# Altium schematic sheet Relay off delay.SchDoc
size A4
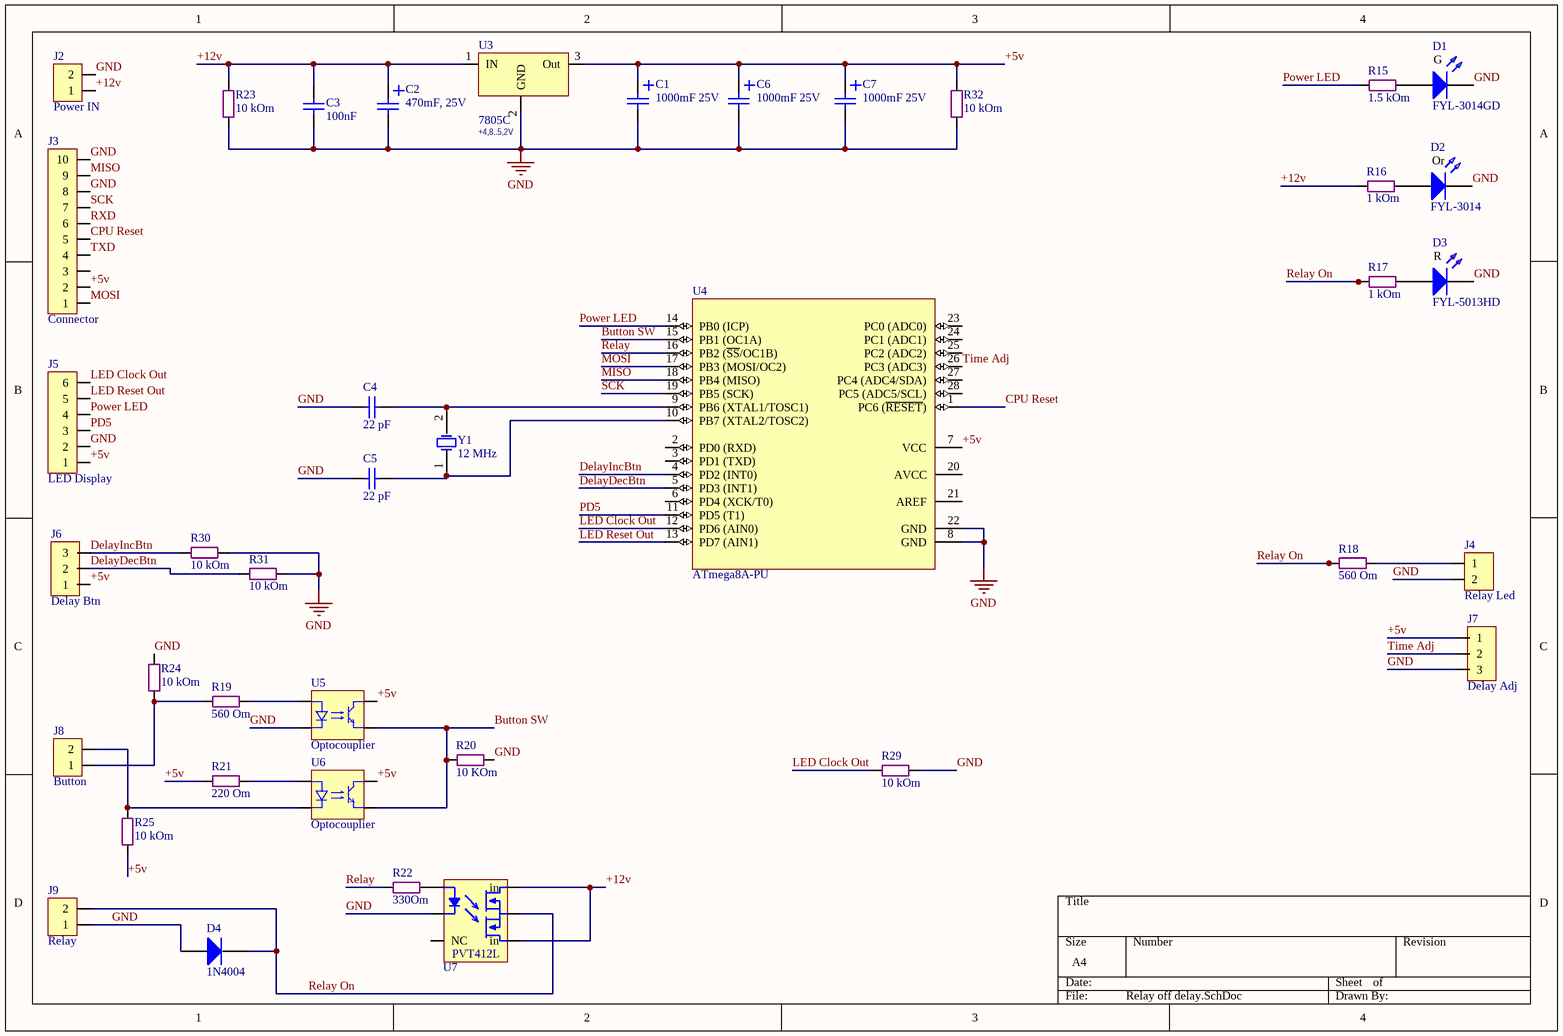
[diagram p0: Relay off delay.SchDoc]

## Parts
C1  1000mF 25V  [Cap E p5.08mm D10.2mm (3p)]
C2  470mF, 25V  [Cap E p3.5mm D8xH12]
C3  100nF  [Cap P5.08MM (3p) disk2]
C4  22 pF  [Cap P5.08MM (3p) disk2]
C5  22 pF  [Cap P5.08MM (3p) disk2]
C6  1000mF 25V  [Cap E p5.08mm D10.2mm (3p)]
C7  1000mF 25V  [Cap E p5.08mm D10.2mm (3p)]
D1  FYL-3014GD  [LED Round 3mm Green]
D2  FYL-3014  [LED Round 3mm Yellow]
D3  FYL-5013HD  [LED Round 3mm red]
D4  1N4004  [Diode DO-35]
J2  Power IN  [CWF-2 R]
J3  Connector  [LINE 2.54 x 10D (2 x 5) - BH]
J4  Relay Led  [CWF-2 R]
J5  LED Display  [Molex Micro-Fit 3.0 - 6 pin D R]
J6  Delay Btn  [WF-3]
J7  Delay Adj  [WF-3]
J8  Button  [CWF-2 R]
J9  Relay  [CWF-2 R]
R15  1.5 kOm  [SMD 0805 (2012)]
R16  1 kOm  [SMD 0805 (2012)]
R17  1 kOm  [SMD 0805 (2012)]
R18  560 Om  [SMD 0805 (2012)]
R19  560 Om  [SMD 0805 (2012)]
R20  10 KOm  [SMD 0805 (2012)]
R21  220 Om  [SMD 0805 (2012)]
R22  330Om  [SMD 1206 (3216)]
R23  10 kOm  [SMD 0805 (2012)]
R24  10 kOm  [SMD 0805 (2012)]
R25  10 kOm  [SMD 0805 (2012)]
R29  10 kOm  [Res p7.62 (4p) 0.25w]
R30  10 kOm  [Res p7.62 (4p) 0.25w]
R31  10 kOm  [Res p7.62 (4p) 0.25w]
R32  10 kOm  [SMD 0805 (2012)]
U3  7805C  V Out: +4,8..5,2V  [D-PAK]
U4  ATmega8A-PU  [28P3]
U5  Optocouplier  [DIP-4]
U6  Optocouplier  [DIP-4]
U7  PVT412L  [DIP-6]  (value not drawn)
Y1  12 MHz  [XTAL - 2]

## Nets
GND: C1.2 C2.2 C3.2 C4.1 C5.1 C6.2 C7.2 D1.K D2.K D3.K D4.A J2.2 J3.8 J3.10 J4.2 J5.2 J7.3 J9.1 R20.2 R23.1 R24.2 R29.2 R30.1 R31.1 R32.1 U3.2(GND) U4.8(GND) U4.22(GND) U5.2 U7.2
+5v: C1.1 C6.1 C7.1 J3.2 J5.1 J6.1 J7.1 R21.1 R25.1 R32.2 U3.3(Out) U4.7(VCC) U5.3 U6.3
+12v: C2.1 C3.1 J2.1 R16.1 R23.2 U3.1(IN) U7.4(in) U7.6(in)
Button SW: R20.1 U4.15(PB1_(OC1A)) U5.4 U6.4
CPU Reset: J3.5 U4.1(PC6_(~{RESET}))
DelayDecBtn: J6.2 R31.2 U4.5(PD3_(INT1))
DelayIncBtn: J6.3 R30.2 U4.4(PD2_(INT0))
LED Clock Out: J5.6 R29.1 U4.12(PD6_(AIN0))
LED Reset Out: J5.5 U4.13(PD7_(AIN1))
MISO: J3.9 U4.18(PB4_(MISO))
MOSI: J3.1 U4.17(PB3_(MOSI/OC2))
PD5: J5.3 U4.11(PD5_(T1))
Power LED: J5.4 R15.1 U4.14(PB0_(ICP))
Relay: R22.1 U4.16(PB2_(~{SS}/OC1B))
Relay On: D4.K J9.2 R17.1 R18.1 U7.5
RXD: J3.6
SCK: J3.7 U4.19(PB5_(SCK))
Time Adj: J7.2 U4.26(PC3_(ADC3))
TXD: J3.4
NetC4_2: C4.2 U4.9(PB6_(XTAL1/TOSC1)) Y1.2(OSC2)
NetC5_2: C5.2 U4.10(PB7_(XTAL2/TOSC2)) Y1.1(OSC1)
NetD1_A: D1.A R15.2
NetD2_A: D2.A R16.2
NetD3_A: D3.A R17.2
NetJ4_1: J4.1 R18.2
NetJ8_1: J8.1 R19.1 R24.1
NetJ8_2: J8.2 R25.2 U6.2
NetR19_2: R19.2 U5.1
NetR21_2: R21.2 U6.1
NetR22_2: R22.2 U7.1

Not connected (* = marked no-connect by the designer): J3 3; U4 2(PD0_(RXD)) 3(PD1_(TXD)) 6(PD4_(XCK/T0)) 20(AVCC) 21(AREF) 23(PC0_(ADC0)) 24(PC1_(ADC1)) 25(PC2_(ADC2)) 27(PC4_(ADC4/SDA)) 28(PC5_(ADC5/SCL)); U7 3(NC)

## Notes on the sheet
- (in symbol Led Round 3mm Green) G
- (in symbol Led Round 3mm Orange) Or
- (in symbol Led Round 3mm Red) R

## Library data of the parts
C1 C6 C7 = Cap E 1000mF x 25V: Capacitor
C2 = Cap E 470mF x 25V: Capacitor; Capacity (mF): 470; Voltage (V): 25; Value: 470mF, 25V
C3-C5 = Cap Ceramic: Capacitor
D1 = Led Round 3mm Green: 2.1v 10mA, 15-30mCd; Forward Voltage Max: 2.3; Forward Voltage TYP: 2.1; Wave len min/typ: 570nm; Liminous Typ (mcd): 15-30; Forward Amp (mA): 10; Color: Green; Name: FYL-3014GD
D2 = Led Round 3mm Orange: 2.1v 10mA, 30mCd; Forward Voltage TYP: 2.1; Wave len min/typ: ?nm; Liminous Typ (mcd): 15-30; Forward Amp (mA): 10; Color: Orange; Forward Voltage Max: ?; Name: FYL-3014
D3 = Led Round 3mm Red: 2.25v 10mA, 5mCd; Forward Voltage Max: 2.5; Forward Voltage TYP: 2.25; Wave len min/typ: 700nm; Liminous Typ (mcd): 5; Forward Amp (mA): 10; Color: Red; Name: FYL-5013HD
D4 = Diode 1N4004: 1 Amp General Purpose Rectifier; PackageReference: DO-41; PackageDescription: Diode, Axial; Body 5.2 x 2.7 mm (LxDia. max), Lead Dia. 0.86 mm (max); Code_JEDEC: DO-204-AL; ComponentLink1Description: Manufacturer Link; ComponentLink1URL: http://www.fairchildsemi.com/; ComponentLink2Description: Datasheet; ComponentLink2URL: http://www.fairchildsemi.com/ds/1N%2F1N4001.pdf; VALUE: 1N4004
J2 J4 J8 J9 = CWF-2 (R): CWF series
J3 = PLD-10 (2 x 5): Vert, Dbl line, Male
J5 = Micro-Fit 6R (2x3): Horisontal, Dbl line, Male - 3mm
J6 J7 = WF-3: Standart Fan MB's Connector
R15-R21 = Res SMD 0805
R22-R25 R29-R32 = Res All Types
U3 = 7805C: Voltage Regulator; Manufacturer: Интеграл; I output (A): 1; Max Voltage In (V): 35; Напряжение выход-вход (dropout): >2V; t: -10..+70°C; Case: D2PAK; Shema: http://tec.org.ru/_bd/5/57349922.jpg; Name: 7805C
U4 = ATmega8A-PU: 8-bit AVR Microcontroller, 8KB Flash, 512 Bytes EEPROM, 1KB SRAM, 28-pin PDIP, Industrial Grade (-40°C to 85°C); Published: 1-Apr-2010; DatasheetVersion: revC, Jul-2009; PackageVersion: revB, Sep-2001; PackageReference: 28P3; Publisher: Altium Limited; PackageDescription: 28-lead (0.300"/7.62mm Wide) Plastic Dual Inline Package (PDIP); Supplier 1: Digi-Key; Supplier Part Number 1: ATMEGA8A-PU-ND; Supplier 2: Farnell; Supplier Part Number 2: 1748534; Supplier 3: Mouser; Supplier Part Number 3: 556-ATMEGA8A-PU; ComponentLink1Description: Manufacturer Link; ComponentLink1URL: http://www.atmel.com/products/avr/default.asp?; ComponentLink2Description: ATmega8A Datasheet; ComponentLink2URL: http://www.atmel.com/dyn/resources/prod_documents/doc8159.pdf; ComponentLink3Description: ATmega8A Summary; ComponentLink3URL: http://www.atmel.com/dyn/resources/prod_documents/8159S.pdf; ComponentLink4Description: Atmel.com Home; ComponentLink4URL: http://www.atmel.com
U5 U6 = Optocouplier LTV 817B: LTV817 Datasheet: http://lib.chipdip.ru/222/DOC000222300.pdf; Name: LTV817B
U7 = Opto Rlay PVT412L: Opto relay 2 chanel, MOSFET; Datasheet: http://tec.org.ru/board/0-0-0-1979-20; Name: PVT412L; URL: http://tec.org.ru/board/pvt412l/147-1-0-1979
Y1 = XTAL: Crystal Oscillator; Published: 8-Jun-2000; LatestRevisionDate: 17-Jul-2002; LatestRevisionNote: Re-released for DXP Platform.; PackageReference: R38; Publisher: Altium Limited; PackageDescription: Crystal, Thru-Hole; 2 Leads; Body 3.1 x 8.2 mm (Dia.xH)